# Altium project Viper22PS.PrjPcb
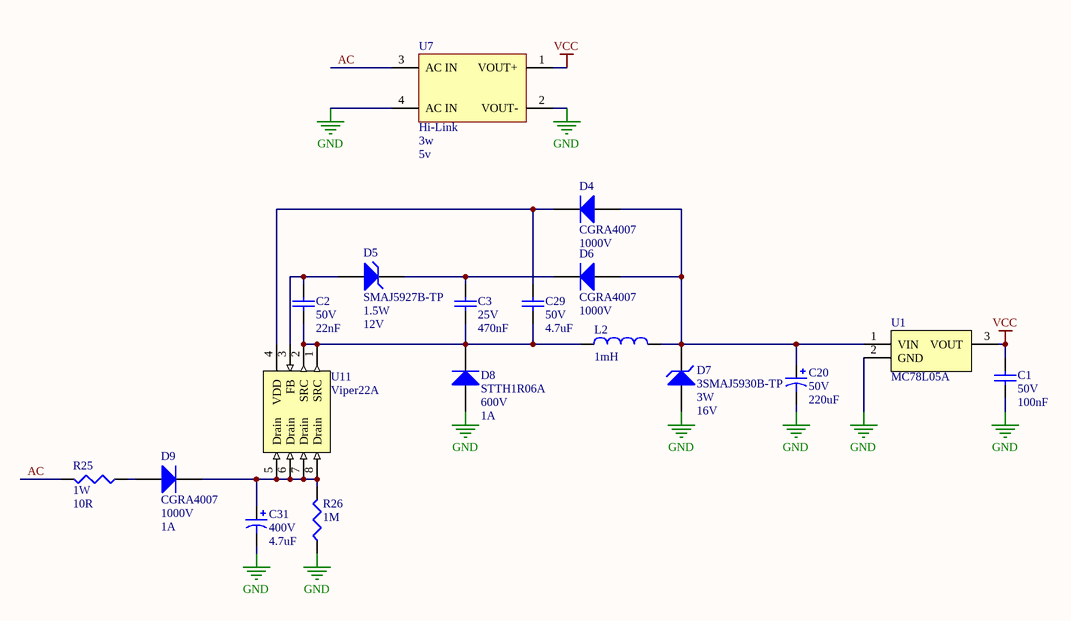
[diagram p0: Viper22PS.SchDoc]
1 sheet, 18 parts. Net scope: global (net labels, ports and power ports of the same name join across sheets).
Board files: Viper22PS.PcbDoc, Viper22PS_x8.PcbDoc

## Sheet Viper22PS.SchDoc: Viper22 Power Supply
size A4; Revision: V1.0; SheetNumber: 1; SheetTotal: 1

### Parts
C1  value 100nF  Tensão: 50V  [CC0603]  (hidden comment: Capacitor Cerâmico)
C2  value 22nF  Tensão: 50V  [CC0603]  (hidden comment: Capacitor Cerâmico)
C3  value 470nF  Tensão: 25V  [CC0603]  (hidden comment: Capacitor Cerâmico)
C20  value 220uF  Tensão: 50V  [CPOLRAD10X20]  (hidden comment: Capacitor Aluminio)
C29  value 4.7uF  Tensão: 50V  [CC0805]  (hidden comment: Capacitor Cerâmico)
C31  value 4.7uF  Tensão: 400V  [CPOLRAD8X12]  (hidden comment: Capacitor Eletrolítico)
D4  CGRA4007  Tensão: 1000V  [SMA]
D5  SMAJ5927B-TP  Potência: 1.5W  Tensão: 12V  [SMA]
D6  CGRA4007  Tensão: 1000V  [SMA]
D7  3SMAJ5930B-TP  Potência: 3W  Tensão: 16V  [SMA]
D8  STTH1R06A  Tensão: 600V  Corrente: 1A  [SMA]
D9  CGRA4007  Tensão: 1000V  Corrente: 1A  [SMA]
L2  value 1mH  [Indutor_Viper]  (hidden comment: Indutor)
R25  value 10R  Potência: 1W  [CC1206]  (hidden comment: Resistor)
R26  value 1M  [CC1206]  (hidden comment: Resistor)
U1  MC78L05A  [SOT-89-3N]
U7  Hi-Link  Potência: 3w  Tensão: 5v  [Fonte-HILINK]
U11  Viper22A  [DIP8]

### Nets
GND: C1.1 C20.2 C31.2 D7.1(A) D8.1(A) R26.1 U1.2(GND) U7.2(VOUT-) U7.4(AC_IN)
VCC: C1.2 U1.3(VOUT) U7.1(VOUT+)
AC: R25.2 U7.3(AC_IN)
NetC2_1: C2.1 C3.1 C29.1 D8.2(K) L2.1 U11.1(SRC) U11.2(SRC)
NetC2_2: C2.2 D5.1(A) U11.3(FB)
NetC3_2: C3.2 D5.2(K) D6.2(K)
NetC20_1: C20.1 D4.1(A) D6.1(A) D7.2(K) L2.2 U1.1(VIN)
NetC29_2: C29.2 D4.2(K) U11.4(VDD)
NetC31_1: C31.1 D9.2(K) R26.2 U11.5(Drain) U11.6(Drain) U11.7(Drain) U11.8(Drain)
NetD9_1: D9.1(A) R25.1

### Notes on the sheet
- Projeto:
- Tamanho:
- Data:
- A4
- Eng. Felipe Navarro
- Hora:
- Revisão:
- Folha
- de
- Arquivo:

### Library data of the parts
C1 = Cap 100nF 50V 0603 X7R: Capacitor (Semiconductor SIM Model); Chinês: Local; ChinesePrice: 0,00250; Corrente: *A; Potência: *W; Obs:: X7R; Tolerância: ±10%; Supplier 1: Digi-Key; Supplier Part Number 1: 1276-1000-1-ND; ComponentLink1Description: Datasheet; ComponentLink1URL: D:\Tecnoclade\Datasheet\!DataMissing.pdf
C2 = Cap 22nF 50V 0603 X7R: Capacitor (Semiconductor SIM Model); Chinês: -----; ChinesePrice: 0,00000; Corrente: *A; Potência: *W; Obs:: X7R; Tolerância: ±10%; Supplier 1: Digi-Key; Supplier Part Number 1: 445-1312-1-ND; ComponentLink1Description: Datasheet; ComponentLink1URL: D:\Tecnoclade\Datasheet\!DataMissing.pdf
C3 = Cap 470nF 25V 0603 X7R: Capacitor (Semiconductor SIM Model); Chinês: Local; ChinesePrice: 0,00930; Corrente: *A; Potência: *W; Obs:: X7R; Tolerância: ±10%; Supplier 1: Digi-Key; Supplier Part Number 1: 587-2670-1-ND; ComponentLink1Description: Datasheet; ComponentLink1URL: D:\Tecnoclade\Datasheet\!DataMissing.pdf
C20 = PCap 220uF 50V CPOLRAD10X20 LOESR: Polarized Capacitor; ChinesePrice: 0,00000; Chinês: -----; Corrente: 970mA (Ripple); Potência: *W; Obs: LOESR (0R19); Tolerância: ±20%; Supplier 1: Digi-Key; Supplier Part Number 1: 565-3452-ND; ComponentLink1Description: Datasheet; ComponentLink1URL: D:\Tecnoclade\Datasheet\Capacitor e_PZA.pdf
C29 = Cap 4.7uF 50V 0805 X5R: Capacitor (Semiconductor SIM Model); Chinês: -----; ChinesePrice: 0,00000; Corrente: *A; Potência: *W; Obs:: X5R; Tolerância: ±10%; Supplier 1: Digi-Key; Supplier Part Number 1: 1276-1248-1-ND; ComponentLink1Description: Datasheet; ComponentLink1URL: D:\Tecnoclade\Datasheet\!DataMissing.pdf
C31 = PCap 4.7uF 400V 8d.x12h.: Polarized Capacitor (Radial); ChinesePrice: 0,00000; Chinês: ----; Corrente: *A; Potência: *W; Obs: 400PX4R7MEFC8X11.5 - Alumínio; Tolerância: ±20%; Supplier 1: Digi-Key; Supplier Part Number 1: 1189-1850-ND; ComponentLink1Description: Datasheet; ComponentLink1URL: D:\Tecnoclade\Datasheet\!DataMissing.pdf
D4 D6 D9 = DP 1000V 1A SMA: 1 Amp General Purpose Rectifier; ChinesePrice: 0,00930; Chinês: Local; Obs:: Standard Recovery >500ns, > 200mA (Io); Supplier 1: Digi-Key; Supplier Part Number 1: 641-1018-1-ND; Potência: *; Value: *; Tolerância: *; ComponentLink1Description: Datasheet; ComponentLink1URL: D:\Tecnoclade\Datasheet\!DataMissing.pdf
D5 = DZ 12V 1.5W SMA: Zener Diode; ChinesePrice: 0,00000; Chinês: ----; Value: Z=6R5; Obs:: Vf=1V5@200mA; Tolerância: ±5%; Corrente: *; Supplier 1: Digi-Key; Supplier Part Number 1: SMAJ5927BTPMSCT-ND; ComponentLink1Description: Datasheet; ComponentLink1URL: D:\Tecnoclade\Datasheet\!DataMissing.pdf
D7 = DZ 16V 3W SMA: Zener Diode; ChinesePrice: 0,00000; Chinês: ----; Value: Z=10R; Obs:: Vf=1V5@200mA; Tolerância: ±5%; Corrente: *; Supplier 1: Digi-Key; Supplier Part Number 1: 3SMAJ5930B-TPMSCT-ND; ComponentLink1Description: Datasheet; ComponentLink1URL: D:\Tecnoclade\Datasheet\!DataMissing.pdf
D8 = DP 600V 1A SMA (2): 1 Amp General Purpose Rectifier; ChinesePrice: 0,00000; Chinês: ----; Obs:: Fast Recover; Supplier 1: Digi-Key; Supplier Part Number 1: 497-3765-1-ND; Potência: *; Value: *; Tolerância: *; ComponentLink1Description: Datasheet; ComponentLink1URL: D:\Tecnoclade\Datasheet\!DataMissing.pdf
L2 = Ind 1mH 1211 70mA: Inductor Shielded; ChinesePrice: 0,00000; Chinês: -----; Tolerância: ±10%; Potência: *; Supplier 1: Digi-Key; Tensão: *; ComponentLink1Description: Datasheet; ComponentLink1URL: D:\Tecnoclade\Datasheet\!DataMissing.pdf; Substituição: 21/01/2016
R25 = THRes 10R 5% 1020 1W: Fusible Thin Film Chip Resistors; ChinesePrice: 0,00000; Chinês: ----; Corrente: *A; Tensão: *V; Obs: ±100ppm/ºC; Tolerância: ±5%; Supplier 1: Digi-Key; Supplier Part Number 1: M251206-10BCT-ND; ComponentLink1Description: Datasheet; ComponentLink1URL: http://www.vishay.com/docs/20031/m25_si.pdf
R26 = Res 1M 1% 1206 1/4W: ChinesePrice: 0,00000; Chinês: -----; Corrente: *A; Potência: 1/4W; Tensão: *V; Obs: ±100ppm/ºC; Tolerância: ±1%; Supplier 1: Digi-Key; Supplier Part Number 1: RMCF1206FT1M00CT-ND; ComponentLink1Description: Datasheet; ComponentLink1URL: D:\Tecnoclade\Datasheet\!DataMissing.pdf
U1 = MC78L05: Regulador Linear 5V; Chinês: -----; Corrente: 100mA; ChinesePrice: 0,00000; Potência: *; Value: *; Supplier 1: Digi-Key; Supplier Part Number 1: MC78L05ACHXCT-ND; Tensão: 5V; Obs:: *; Tolerância: *; ComponentLink1Description: Datasheet; ComponentLink1URL: D:\Tecnoclade\Datasheet\
U7 = Fonte Hi-Link: Fonte chaveada isolada; ChinesePrice: 0,00000; Chinês: ----; Corrente: 4; Supplier 1: Digi-Key; Value: *; Obs:: *; Tolerância: *; ComponentLink1Description: Datasheet; ComponentLink1URL: D:\Tecnoclade\Datasheet\IE1212S.pdf
U11 = Viper22A: Low power OFF-line SMPS primary switcher; ChinesePrice: 0,00000; Chinês: -----; Value: Driver; Corrente: *; Potência: *; Supplier 1: Digi-Key; Supplier Part Number 1: 497-7694-5-ND; Tensão: *; Obs:: *; Tolerância: *; ComponentLink1Description: Datasheet; ComponentLink1URL: http://www.st.com/web/en/resource/technical/document/datasheet/CD00087939.pdf